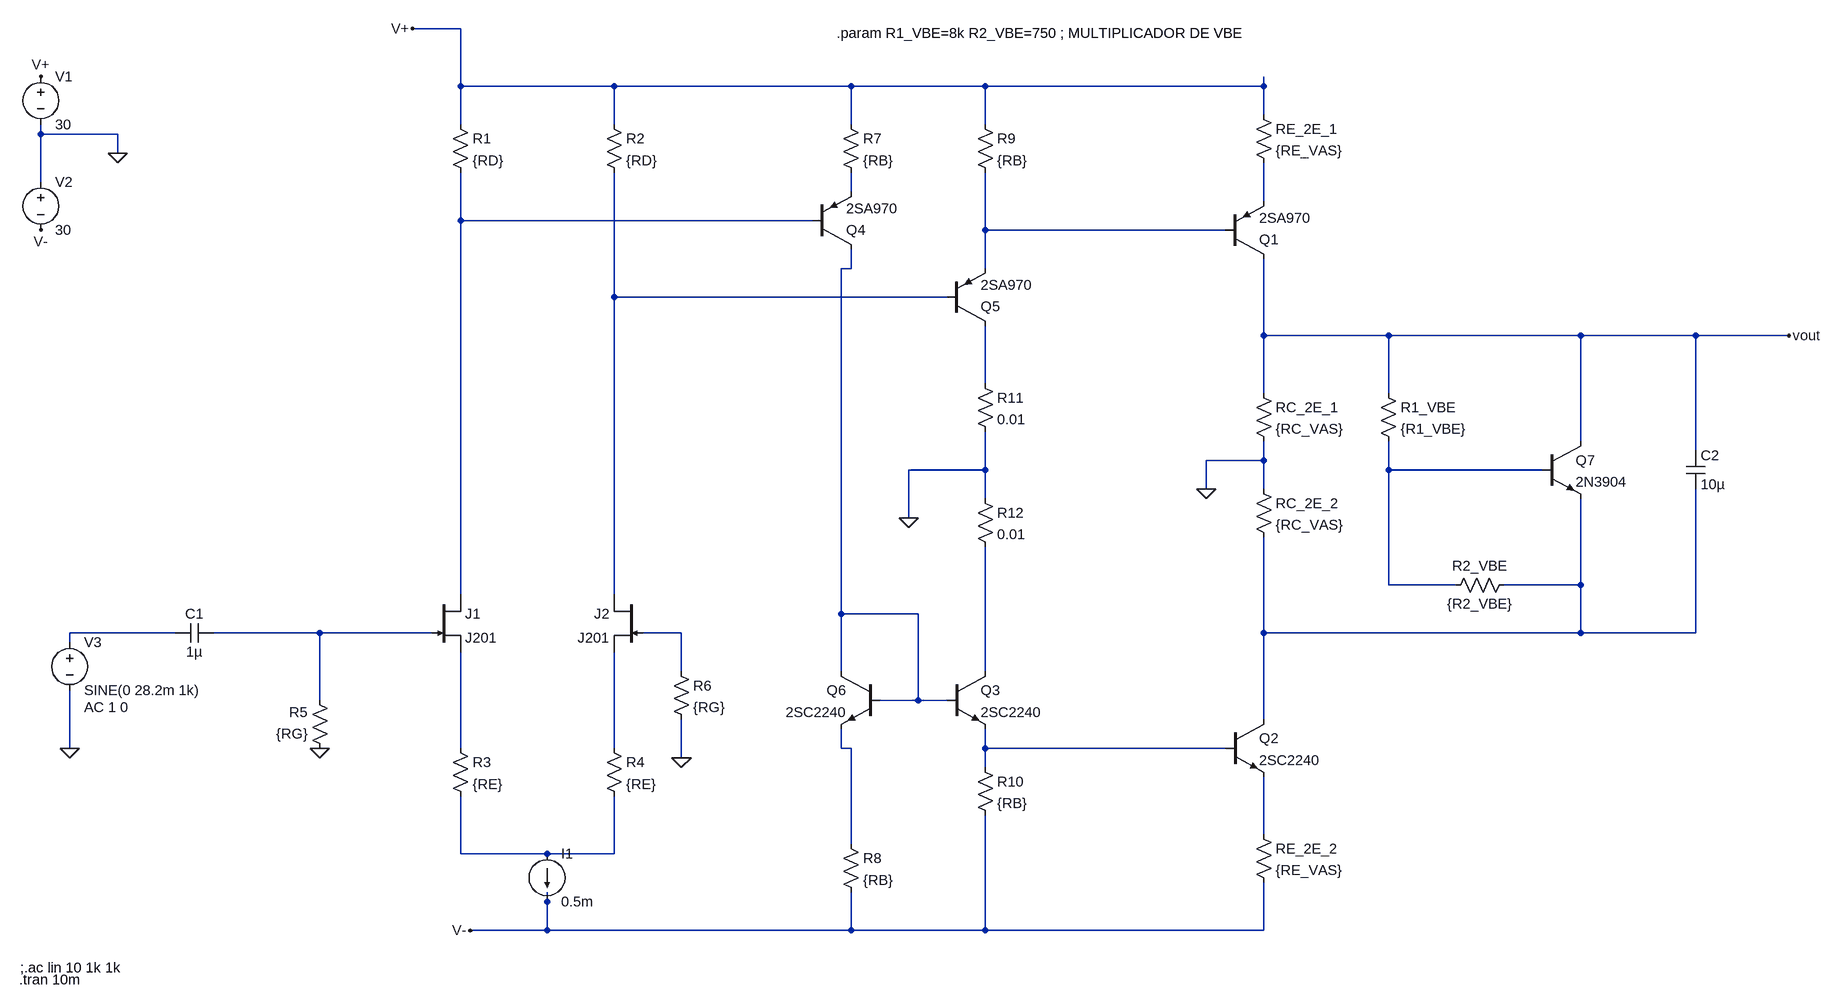
[diagram p0: schematic 2E_JFET_FREQ.asc]
2E_JFET_FREQ.asc, the LTspice schematic file:
Version 4
SHEET 1 6468 1752
WIRE 176 -496 96 -496
WIRE 176 -400 176 -496
WIRE 432 -400 176 -400
WIRE 1040 -400 432 -400
WIRE 1264 -400 1040 -400
WIRE 1728 -400 1728 -416
WIRE 1728 -400 1264 -400
WIRE 1728 -352 1728 -400
WIRE 176 -336 176 -400
WIRE 432 -336 432 -400
WIRE 1040 -336 1040 -400
WIRE 1264 -336 1264 -400
WIRE -592 -320 -592 -336
WIRE -464 -320 -592 -320
WIRE -464 -288 -464 -320
WIRE -592 -240 -592 -320
WIRE 1040 -224 1040 -256
WIRE 1728 -208 1728 -272
WIRE 176 -176 176 -256
WIRE 976 -176 176 -176
WIRE 1264 -160 1264 -256
WIRE 1664 -160 1264 -160
WIRE 1040 -96 1040 -128
WIRE 1040 -96 1024 -96
WIRE 1264 -96 1264 -160
WIRE 432 -48 432 -256
WIRE 1200 -48 432 -48
WIRE 1728 16 1728 -112
WIRE 1936 16 1728 16
WIRE 2256 16 1936 16
WIRE 2448 16 2256 16
WIRE 2640 16 2448 16
WIRE 1264 96 1264 0
WIRE 1728 112 1728 16
WIRE 1936 112 1936 16
WIRE 2256 192 2256 16
WIRE 2448 208 2448 16
WIRE 1728 224 1728 192
WIRE 1728 224 1632 224
WIRE 1264 240 1264 176
WIRE 1264 240 1136 240
WIRE 1936 240 1936 192
WIRE 2192 240 1936 240
WIRE 1632 272 1632 224
WIRE 1728 272 1728 224
WIRE 1264 288 1264 240
WIRE 1136 320 1136 240
WIRE 1936 432 1936 240
WIRE 2048 432 1936 432
WIRE 2256 432 2256 288
WIRE 2256 432 2128 432
WIRE 176 448 176 -176
WIRE 432 448 432 -48
WIRE 1024 480 1024 -96
WIRE 1152 480 1024 480
WIRE -368 512 -544 512
WIRE -112 512 -304 512
WIRE 128 512 -112 512
WIRE 544 512 480 512
WIRE 1728 512 1728 352
WIRE 2256 512 2256 432
WIRE 2256 512 1728 512
WIRE 2448 512 2448 272
WIRE 2448 512 2256 512
WIRE -544 528 -544 512
WIRE 544 576 544 512
WIRE 1024 576 1024 480
WIRE 1264 576 1264 368
WIRE -112 624 -112 512
WIRE 1152 624 1152 480
WIRE 1152 624 1088 624
WIRE 1200 624 1152 624
WIRE 1728 656 1728 512
WIRE -544 704 -544 608
WIRE 176 704 176 544
WIRE 432 704 432 544
WIRE 1024 704 1024 672
WIRE 1040 704 1024 704
WIRE 1264 704 1264 672
WIRE 1664 704 1264 704
WIRE 544 720 544 656
WIRE 1264 736 1264 704
WIRE 1728 848 1728 752
WIRE 1040 864 1040 704
WIRE 176 880 176 784
WIRE 320 880 176 880
WIRE 432 880 432 784
WIRE 432 880 320 880
WIRE 320 960 320 944
WIRE 320 1008 320 960
WIRE 320 1008 192 1008
WIRE 1040 1008 1040 944
WIRE 1040 1008 320 1008
WIRE 1264 1008 1264 816
WIRE 1264 1008 1040 1008
WIRE 1728 1008 1728 928
WIRE 1728 1008 1264 1008
FLAG -464 -288 0
FLAG -592 -416 V+
FLAG -592 -160 V-
FLAG 544 720 0
FLAG 192 1008 V-
FLAG 96 -496 V+
FLAG -544 704 0
FLAG -112 704 0
FLAG 1136 320 0
FLAG 1632 272 0
FLAG 2640 16 vout
SYMBOL voltage -592 -432 R0
WINDOW 123 0 0 Left 0
WINDOW 39 0 0 Left 0
SYMATTR InstName V1
SYMATTR Value 30
SYMBOL voltage -592 -256 R0
WINDOW 123 0 0 Left 0
WINDOW 39 0 0 Left 0
SYMATTR InstName V2
SYMATTR Value 30
SYMBOL current 320 880 R0
WINDOW 123 0 0 Left 0
WINDOW 39 0 0 Left 0
SYMATTR InstName I1
SYMATTR Value 0.5m
SYMBOL res 160 -352 R0
SYMATTR InstName R1
SYMATTR Value {RD}
SYMBOL res 416 -352 R0
SYMATTR InstName R2
SYMATTR Value {RD}
SYMBOL res 1024 -352 R0
SYMATTR InstName R7
SYMATTR Value {RB}
SYMBOL res 1248 -352 R0
SYMATTR InstName R9
SYMATTR Value {RB}
SYMBOL res 1024 848 R0
SYMATTR InstName R8
SYMATTR Value {RB}
SYMBOL res 1248 720 R0
SYMATTR InstName R10
SYMATTR Value {RB}
SYMBOL npn 1200 576 R0
SYMATTR InstName Q3
SYMATTR Value 2SC2240
SYMBOL pnp 976 -128 M180
SYMATTR InstName Q4
SYMATTR Value 2SA970
SYMBOL res 160 688 R0
SYMATTR InstName R3
SYMATTR Value {RE}
SYMBOL res 416 688 R0
SYMATTR InstName R4
SYMATTR Value {RE}
SYMBOL res -96 720 R180
WINDOW 0 36 76 Left 2
WINDOW 3 36 40 Left 2
SYMATTR InstName R5
SYMATTR Value {RG}
SYMBOL res 528 560 R0
SYMATTR InstName R6
SYMATTR Value {RG}
SYMBOL pnp 1200 0 M180
SYMATTR InstName Q5
SYMATTR Value 2SA970
SYMBOL npn 1088 576 M0
SYMATTR InstName Q6
SYMATTR Value 2SC2240
SYMBOL voltage -544 512 R0
WINDOW 123 24 124 Left 2
WINDOW 39 0 0 Left 0
SYMATTR Value2 AC 1 0
SYMATTR InstName V3
SYMATTR Value SINE(0 28.2m 1k)
SYMBOL njf 128 448 R0
SYMATTR InstName J1
SYMATTR Value J201
SYMBOL njf 480 448 M0
SYMATTR InstName J2
SYMATTR Value J201
SYMBOL pnp 1664 -112 M180
SYMATTR InstName Q1
SYMATTR Value 2SA970
SYMBOL res 1712 -368 R0
SYMATTR InstName RE_2E_1
SYMATTR Value {RE_VAS}
SYMBOL res 1712 96 R0
SYMATTR InstName RC_2E_1
SYMATTR Value {RC_VAS}
SYMBOL res 1712 256 R0
SYMATTR InstName RC_2E_2
SYMATTR Value {RC_VAS}
SYMBOL npn 1664 656 R0
SYMATTR InstName Q2
SYMATTR Value 2SC2240
SYMBOL res 1712 832 R0
SYMATTR InstName RE_2E_2
SYMATTR Value {RE_VAS}
SYMBOL res 1920 96 R0
SYMATTR InstName R1_VBE
SYMATTR Value {R1_VBE}
SYMBOL res 2144 416 R90
WINDOW 0 0 56 VBottom 2
WINDOW 3 32 56 VTop 2
SYMATTR InstName R2_VBE
SYMATTR Value {R2_VBE}
SYMBOL cap 2432 208 R0
SYMATTR InstName C2
SYMATTR Value 10µ
SYMBOL npn 2192 192 R0
SYMATTR InstName Q7
SYMATTR Value 2N3904
SYMBOL cap -304 496 R90
WINDOW 0 0 32 VBottom 2
WINDOW 3 32 32 VTop 2
SYMATTR InstName C1
SYMATTR Value 1µ
SYMBOL res 1248 80 R0
SYMATTR InstName R11
SYMATTR Value 0.01
SYMBOL res 1248 272 R0
SYMATTR InstName R12
SYMATTR Value 0.01
TEXT 1016 -488 Left 2 !.param R1_VBE=8k R2_VBE=750 ; MULTIPLICADOR DE VBE
TEXT -626 1070 Left 2 !;.ac lin 10 1k 1k
TEXT -628 1090 Left 2 !.tran 10m

The netlist it stands for:
* 2E_JFET_FREQ.asc
V1 V+ 0 30
V2 0 V- 30
I1 N019 V- 0.5m
R1 V+ N003 {RD}
R2 V+ N006 {RD}
R7 V+ N001 {RB}
R9 V+ N004 {RB}
R8 N016 V- {RB}
R10 N017 V- {RB}
Q3 N013 N005 N017 0 2SC2240
Q4 N005 N003 N001 0 2SA970
R3 N014 N019 {RE}
R4 N015 N019 {RE}
R5 0 N011 {RG}
R6 N012 0 {RG}
Q5 N007 N006 N004 0 2SA970
Q6 N005 N005 N016 0 2SC2240
V3 N010 0 SINE(0 28.2m 1k) AC 1 0
J1 N003 N011 N014 J201
J2 N006 N012 N015 J201
Q1 vout N004 N002 0 2SA970
RE_2E_1 V+ N002 {RE_VAS}
RC_2E_1 vout 0 {RC_VAS}
RC_2E_2 0 N009 {RC_VAS}
Q2 N009 N017 N018 0 2SC2240
RE_2E_2 N018 V- {RE_VAS}
R1_VBE vout N008 {R1_VBE}
R2_VBE N009 N008 {R2_VBE}
C2 vout N009 10µ
Q7 vout N008 N009 0 2N3904
C1 N011 N010 1µ
R11 N007 0 0.01
R12 0 N013 0.01
.model NPN NPN
.model PNP PNP
.lib standard.bjt
.model NJF NJF
.model PJF PJF
.lib standard.jft
.param R1_VBE=8k R2_VBE=750 ; MULTIPLICADOR DE VBE
;.ac lin 10 1k 1k
.tran 10m
.backanno
.end